# Altium schematic sheet PIC closed loop.SchDoc
size A3; SheetNumber: 17; SheetTotal: 18
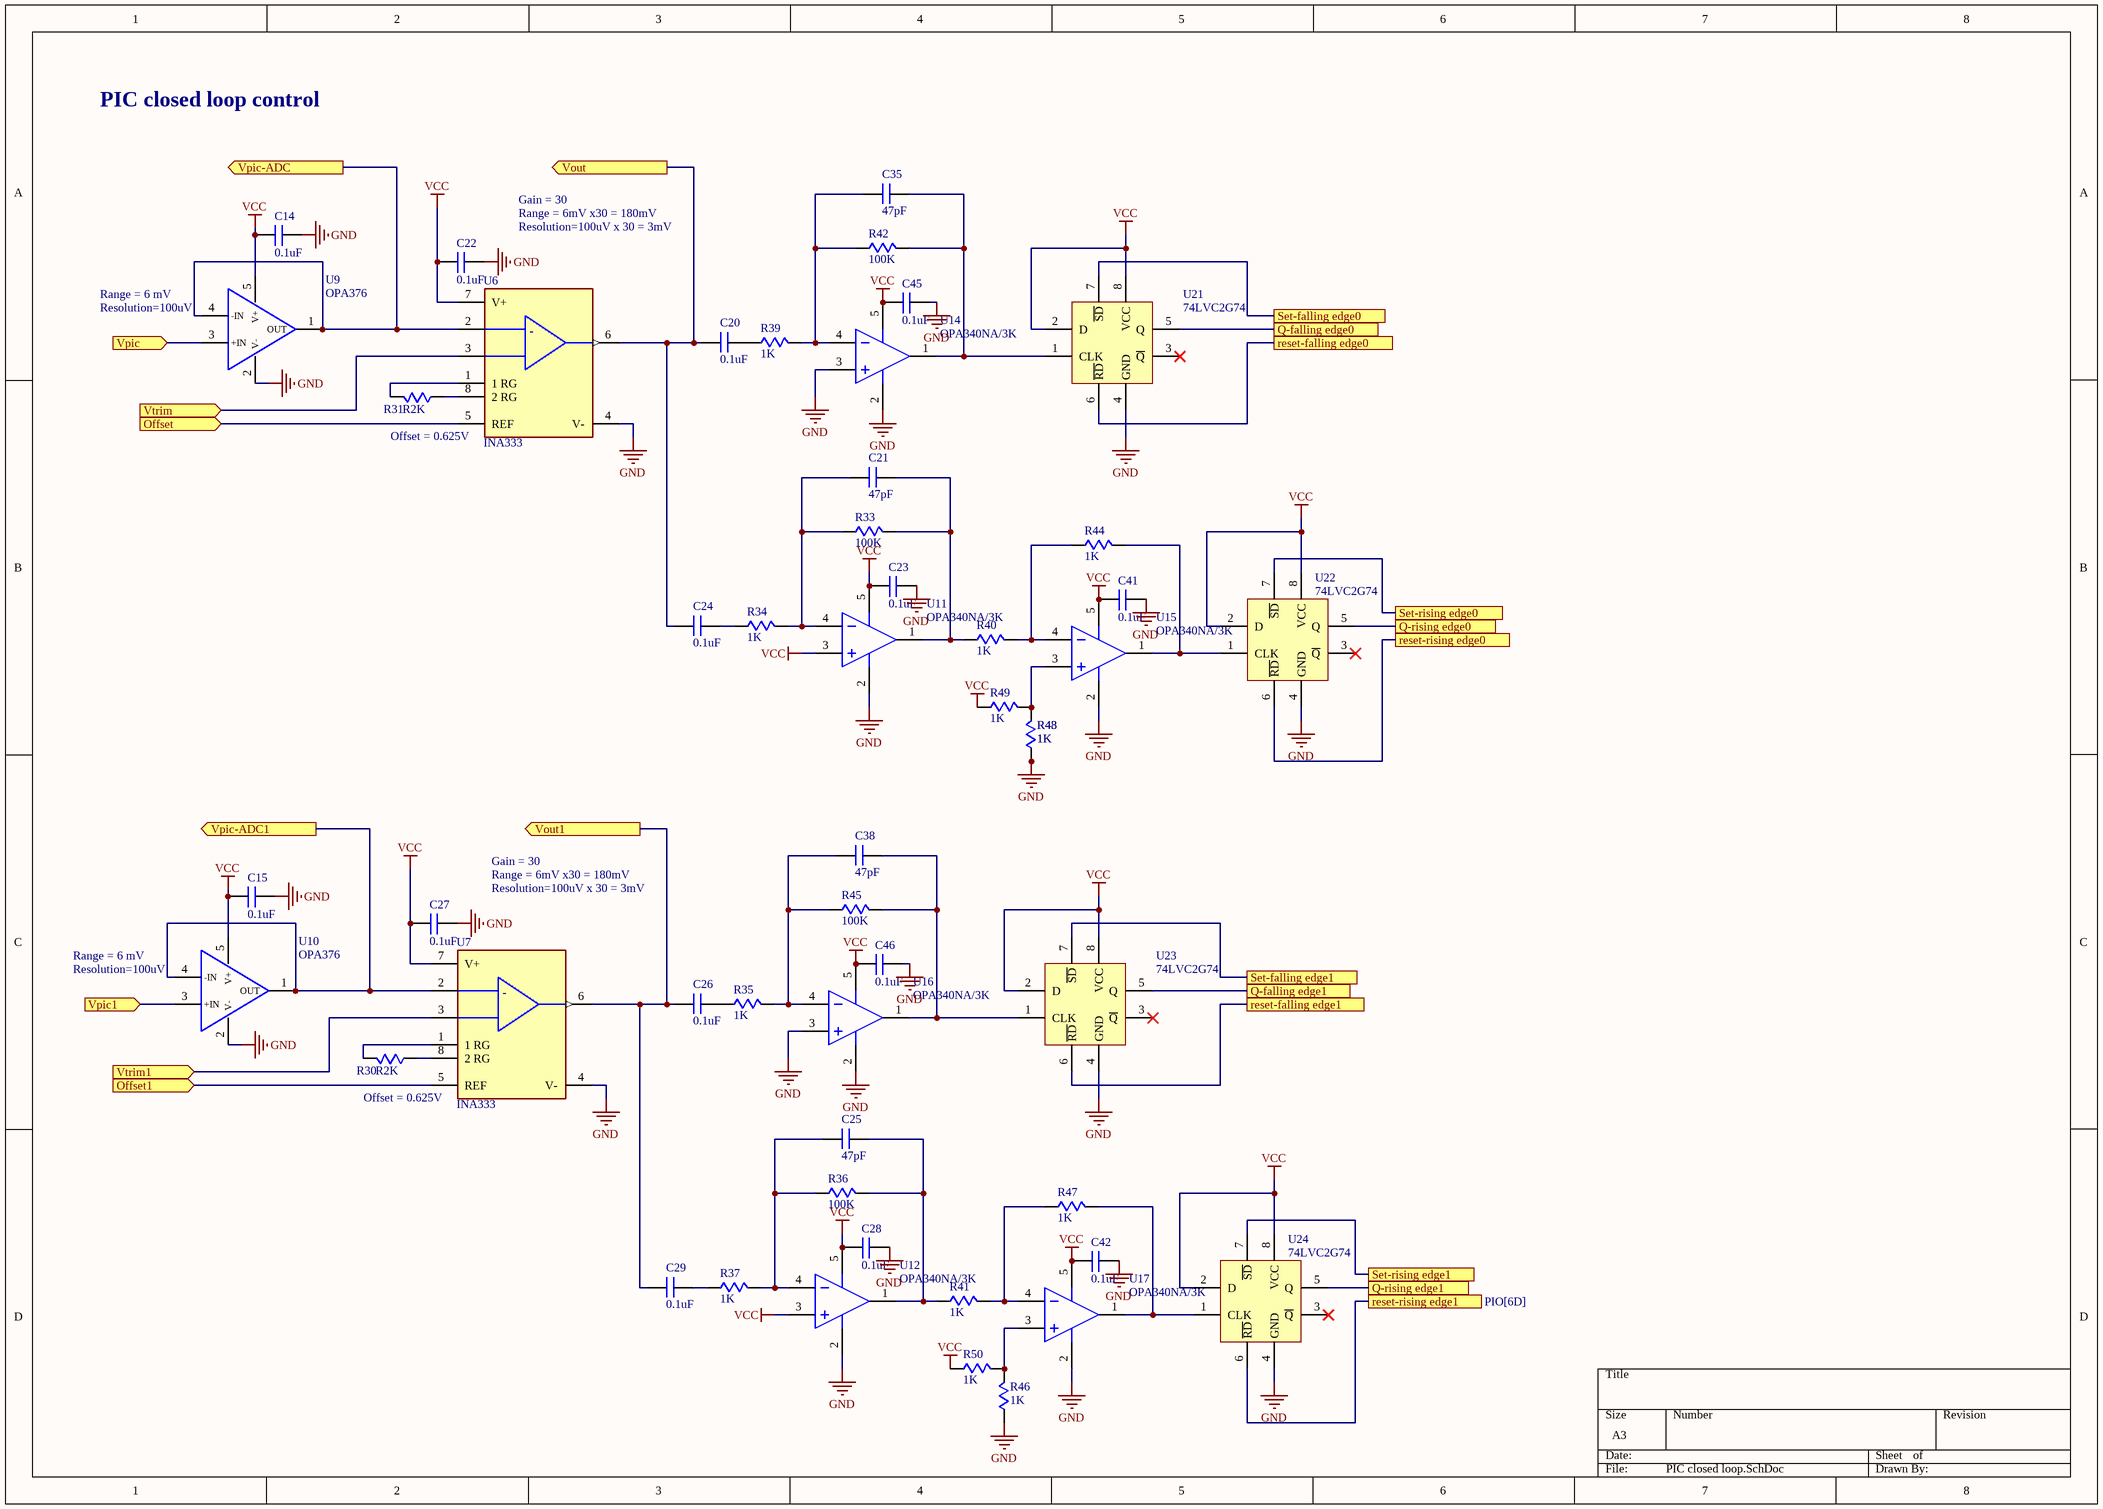
[diagram p0: PIC closed loop.SchDoc]

## Parts
C14  0.1uF  [CAP0603]
C15  0.1uF  [CAP0603]
C20  0.1uF  [CAP0603]
C21  47pF  [CAP0805]
C22  0.1uF  [CAP0603]
C23  0.1uF  [CAP0603]
C24  0.1uF  [CAP0603]
C25  47pF  [CAP0805]
C26  0.1uF  [CAP0603]
C27  0.1uF  [CAP0603]
C28  0.1uF  [CAP0603]
C29  0.1uF  [CAP0603]
C35  47pF  [CAP0805]
C38  47pF  [CAP0805]
C41  0.1uF  [CAP0603]
C42  0.1uF  [CAP0603]
C45  0.1uF  [CAP0603]
C46  0.1uF  [CAP0603]
R30  R2K  [RES0603]
R31  R2K  [RES0603]
R33  100K  [RES0805]
R34  1K  [RES0805]
R35  1K  [RES0805]
R36  100K  [RES0805]
R37  1K  [RES0805]
R39  1K  [RES0805]
R40  1K  [RES0805]
R41  1K  [RES0805]
R42  100K  [RES0805]
R43  1K  [RES0805]
R44  1K  [RES0805]
R45  100K  [RES0805]
R46  1K  [RES0805]
R47  1K  [RES0805]
R48  1K  [RES0805]
R49  1K  [RES0805]
R50  1K  [RES0805]
U6  INA333  [VSSOP-8]
U7  INA333  [VSSOP-8]
U9  OPA376  [SOT-23-5]
U10  OPA376  [SOT-23-5]
U11  OPA340NA/3K  [SOT-23]
U12  OPA340NA/3K  [SOT-23]
U14  OPA340NA/3K  [SOT-23]
U15  OPA340NA/3K  [SOT-23]
U16  OPA340NA/3K  [SOT-23]
U17  OPA340NA/3K  [SOT-23]
U21  74LVC2G74  [TSSOP8]
U22  74LVC2G74  [TSSOP8]
U23  74LVC2G74  [TSSOP8]
U24  74LVC2G74  [TSSOP8]

## Ports
Offset1 (in, see ADC-DAC[4D]), Offset (in, see ADC-DAC[4D]), Q-falling edge0 (see PIO[2D]), Q-falling edge1 (see PIO[6C]), Q-rising edge0 (see PIO[2D]), Q-rising edge1 (see PIO[6D]), reset-falling edge0 (see PIO[2D]), reset-falling edge1 (see PIO[6C]), reset-rising edge0 (see PIO[2D]), reset-rising edge1 (see PIO[6D]), Set-falling edge0 (see PIO[2C]), Set-falling edge1 (see PIO[6C]), Set-rising edge0 (see PIO[2D]), Set-rising edge1 (see PIO[6D]), Vout1 (out, see ADC-DAC[4C]), Vout (out, see ADC-DAC[4C]), Vpic1 (in, see ADC-DAC[4D]), Vpic (in, see ADC-DAC[4D]), Vpic-ADC1 (out, see ADC-DAC[7A]), Vpic-ADC (out, see ADC-DAC[5B]), Vtrim1 (in, see ADC-DAC[4D]), Vtrim (in, see ADC-DAC[4D])

## Nets
GND: C14.1 C15.1 C22.1 C23.1 C27.1 C28.1 C41.1 C42.1 C45.1 C46.1 R43.1 R46.1 R48.1 U6.4(V-) U7.4(V-) U9.2(V-) U10.2(V-) U11.2(V-) U12.2(V-) U14.2(V-) U14.3(IN+) U15.2(V-) U16.2(V-) U16.3(IN+) U17.2(V-) U21.4(GND) U22.4(GND) U23.4(GND) U24.4(GND)
VCC: C14.2 C15.2 C22.2 C23.2 C27.2 C28.2 C41.2 C42.2 C45.2 C46.2 R49.1 R50.1 U6.7(V+) U7.7(V+) U9.5(V+) U10.5(V+) U11.3(IN+) U11.5(V+) U12.3(IN+) U12.5(V+) U14.5(V+) U15.5(V+) U16.5(V+) U17.5(V+) U21.2(D) U21.8(VCC) U22.2(D) U22.8(VCC) U23.2(D) U23.8(VCC) U24.2(D) U24.8(VCC)
Offset: U6.5(REF) ; port Offset
Offset1: U7.5(REF) ; port Offset1
Q-falling edge0: U21.5(Q) ; port Q-falling edge0
Q-falling edge1: U23.5(Q) ; port Q-falling edge1
Q-rising edge0: U22.5(Q) ; port Q-rising edge0
Q-rising edge1: U24.5(Q) ; port Q-rising edge1
reset-falling edge0: U21.6(~{RD}) ; port reset-falling edge0
reset-falling edge1: U23.6(~{RD}) ; port reset-falling edge1
reset-rising edge0: U22.6(~{RD}) ; port reset-rising edge0
reset-rising edge1: U24.6(~{RD}) ; port reset-rising edge1
Set-falling edge0: U21.7(~{SD}) ; port Set-falling edge0
Set-falling edge1: U23.7(~{SD}) ; port Set-falling edge1
Set-rising edge0: U22.7(~{SD}) ; port Set-rising edge0
Set-rising edge1: U24.7(~{SD}) ; port Set-rising edge1
Vout: C20.1 C24.1 U6.6(VOUT) ; port Vout
Vout1: C26.1 C29.1 U7.6(VOUT) ; port Vout1
Vpic: U9.3(+IN) ; port Vpic
Vpic1: U10.3(+IN) ; port Vpic1
Vpic-ADC: U6.2(VIN-) U9.1(OUT) U9.4(-IN) ; port Vpic-ADC
Vpic-ADC1: U7.2(VIN-) U10.1(OUT) U10.4(-IN) ; port Vpic-ADC1
Vtrim: U6.3(VIN+) ; port Vtrim
Vtrim1: U7.3(VIN+) ; port Vtrim1
NetC20_2: C20.2 R39.1
NetC21_1: C21.1 R33.1 R34.2 U11.4(IN-)
NetC21_2: C21.2 R33.2 R40.1 U11.1(OUT)
NetC24_2: C24.2 R34.1
NetC25_1: C25.1 R36.1 R37.2 U12.4(IN-)
NetC25_2: C25.2 R36.2 R41.1 U12.1(OUT)
NetC26_2: C26.2 R35.1
NetC29_2: C29.2 R37.1
NetC35_1: C35.1 R39.2 R42.1 U14.4(IN-)
NetC35_2: C35.2 R42.2 U14.1(OUT) U21.1(CLK)
NetC38_1: C38.1 R35.2 R45.1 U16.4(IN-)
NetC38_2: C38.2 R45.2 U16.1(OUT) U23.1(CLK)
NetR30_1: R30.1 U7.8(2_RG)
NetR30_2: R30.2 U7.1(1_RG)
NetR31_1: R31.1 U6.8(2_RG)
NetR31_2: R31.2 U6.1(1_RG)
NetR40_2: R40.2 R44.1 U15.4(IN-)
NetR41_2: R41.2 R47.1 U17.4(IN-)
NetR43_2: R43.2 R48.2 R49.2 U15.3(IN+)
NetR44_2: R44.2 U15.1(OUT) U22.1(CLK)
NetR46_2: R46.2 R50.2 U17.3(IN+)
NetR47_2: R47.2 U17.1(OUT) U24.1(CLK)

Not connected (* = marked no-connect by the designer): U21 3(~{Q})*; U22 3(~{Q})*; U23 3(~{Q})*; U24 3(~{Q})*

## Notes on the sheet
- PIC closed loop control
- Range = 6mV x30 = 180mV
- Resolution=100uV x 30 = 3mV
- Gain = 30
- Range = 6 mV
- (near U9) Resolution=100uV
- (near U6) Offset = 0.625V
- (near U10) Resolution=100uV
- (near U7) Offset = 0.625V
- (in symbol INA333AIDGKT) -

## Library data of the parts
C14 C15 C20 C22-C24 C26-C29 C41 C42 C45 C46 = Capacitor 0.1uF: 50V 100nF X5R 卤10% 0603 Multilayer Ceramic Capacitors MLCC - SMD/SMT ROHS; Manufacturer: TDK; Manufacturer Part Number: C1608X5R1H104K080AA; Material: 4241ConductorMaterial; Tolerance: 10%; Supplier: Mouser; Supplier Part Number: 810-C1608X5R1H104K; RoHS: Yes; Category: Ceramic Capacitors; Stock: 239770; Pricing: 1=0.1, 10=0.051, 50=0.051, 100=0.031, 1000=0.021, 10000=0.012 (USD); Mounting Technology: Surface Mount; Case/Package: 0603; Pins: 2NUMBER; Case Code (Metric): 1608; Case Code (Imperial): 0603; Weight: 7.1E-05oz; Dielectric Material: 4241ConductorMaterial; Min Operating Temperature: -55°C; Max Operating Temperature: 85°C; Value: 100nF; Voltage Rating: 50V; Package Quantity: 1; Packaging: Tape and Reel; Voltage Rating (DC): 50V; Dielectric: X5R; Termination: SMD/SMT; Series: C; Construction: Flat; Length: 1.6mm; Width: 0.031inch; Height: 0.8mm; Thickness: 0.035inch; Depth: 0.8mm; Radiation Hardening: No; Reach SVHC Compliant: No; RoHS Compliant: Yes; Lead Free: 5697LeadFree; ComponentLink1URL: https://datasheet.ciiva.com/24219/mlcc-commercial-general-en-24219452.pdf?src-supplier=Mouser; ComponentLink1Description: https://datasheet.ciiva.com/24219/mlcc-commercial-general-en-24219452.pdf?src-supplier=Mouser; ComponentLink2URL: https://datasheet.ciiva.com/7975/1796654-7975081.pdf?src-supplier=Element14; ComponentLink2Description: https://datasheet.ciiva.com/7975/1796654-7975081.pdf?src-supplier=Element14; ComponentLink3URL: https://datasheet.ciiva.com/22694/1796654-22694121.pdf?src-supplier=Element14; ComponentLink3Description: https://datasheet.ciiva.com/22694/1796654-22694121.pdf?src-supplier=Element14; ComponentLink4URL: https://datasheet.ciiva.com/28577/1735394-28577228.pdf?src-supplier=Element14; ComponentLink4Description: https://datasheet.ciiva.com/28577/1735394-28577228.pdf?src-supplier=Element14; ComponentLink5URL: https://datasheet.ciiva.com/6275/tdkmlcccaprange-6275223.pdf?src-supplier=Digikey; ComponentLink5Description: https://datasheet.ciiva.com/6275/tdkmlcccaprange-6275223.pdf?src-supplier=Digikey; Supplier 1: Mouser; Supplier Part Number 1: 810-C1608X5R1H104K
C21 C25 C35 C38 = Capactior 47pF: Cap Cer 4.7PF 100V C0G/NP0 0805; Manufacturer: Wurth Electronics; Manufacturer Part Number: 885012007096; Insulation Resistance: 10GR; Supplier: Mouser; Supplier Part Number: 710-885012007096; RoHS: No; Category: Ceramic Capacitors; Stock: 8470; Voltage Rating (DC): 100V; Length: 2mm; Width: 1.25mm; Height: 600um; ComponentLink1URL: http://www.farnell.com/datasheets/2546659.pdf?src-supplier=Farnell; ComponentLink1Description: http://www.farnell.com/datasheets/2546659.pdf?src-supplier=Farnell; ComponentLink2URL: https://katalog.we-online.de/pbs/datasheet/885012007096.pdf?src-supplier=Digikey; ComponentLink2Description: https://katalog.we-online.de/pbs/datasheet/885012007096.pdf?src-supplier=Digikey; Supplier 1: Mouser; Supplier Part Number 1: 710-885012007096
R30 R31 = Resistor 2K: Res Thin Film 0603 2K Ohm 0.1% 1/10W ±25ppm/°C Molded SMD SMD Paper T/R; Manufacturer: Yageo; Manufacturer Part Number: RT0603BRD072KL; Value: 2kR; Power Rating: 100mW; Voltage Rating: 75V; Voltage Rating (DC): 50V; Supplier: Mouser; Supplier Part Number: 603-RT0603BRD072KL; RoHS: Yes; Category: Chip SMD Resistors; Stock: 66196; Pricing: 1=0.1, 10=0.069, 50=0.061, 100=0.057, 1000=0.052, 10000=0.035 (USD); Case/Package: 0603; Contact Plating: Tin,Matte; Case Code (Imperial): 0603; Weight: 7.1E-05oz; Case Code (Metric): 1608; Min Operating Temperature: -55°C; Max Operating Temperature: 125°C; Tolerance: 0.1%; Temperature Coefficient: 25ppm/°C; Termination: SMD/SMT; Number of Terminations: 2; Max Power Dissipation: 100mW; Features: Moisture Resistant; Package Quantity: 5000; Packaging: Tape and Reel; Series: RT; Length: 0.063inch; Width: 0.8mm; Height: 0.022inch; Lead Free: Lead Free; RoHS Compliant: Yes; ComponentLink1URL: https://datasheet.ciiva.com/8894/pyu-rt-1-to-0-05-rohs-l-4-8894812.pdf?src-supplier=Avnet; ComponentLink1Description: https://datasheet.ciiva.com/8894/pyu-rt-1-to-0-05-rohs-l-4-8894812.pdf?src-supplier=Avnet; ComponentLink2URL: https://datasheet.ciiva.com/2585/pyu-rt-1-to-0-05-rohs-l-4-2585865.pdf?src-supplier=Digikey; ComponentLink2Description: https://datasheet.ciiva.com/2585/pyu-rt-1-to-0-05-rohs-l-4-2585865.pdf?src-supplier=Digikey
R33 R36 R42 R45 = Resistor 100K: Res Thick Film 0805 100K Ohm 5% 0.125W(1/8W) +/-200ppm/ßC SMD Automotive T/R; Manufacturer: Panasonic; Manufacturer Part Number: ERJ-6GEYJ104V; Value: 100kR; Temperature Coefficient: 200ppm/°C; Power Rating: 125mW; Voltage Rating: 150V; Supplier 1: Mouser; Supplier Part Number 1: 279-RN73CA-100K; Supplier: Mouser; Supplier Part Number: 667-ERJ-6GEYJ104V; RoHS: Yes; Category: Chip SMD Resistors; Stock: 35881; Pricing: 1=0.12, 10=0.027, 50=0.027, 100=0.018, 1000=0.015, 10000=0.007 (USD); Mounting Technology: Surface Mount; Case/Package: 0805; Pins: 2NUMBER; Contact Plating: Tin; Case Code (Metric): 2012; Case Code (Imperial): 0805; Weight: 0.000194oz; Min Operating Temperature: -55°C; Max Operating Temperature: 155°C; Tolerance: 5%; Resistor Type: Thick Film; Packaging: Tape and Reel; Package Quantity: 5000; Number of Terminations: 2; Termination: SMD/SMT; Max Power Dissipation: 125mW; Features: Automotive AEC-Q200; Series: ERJ; Technology: THICK FILM; Construction: Rectangular; Resistance Tolerance: 5%; Voltage Rating (DC): 150V; Length: 2mm; Width: 1.25mm; Height: 0.6mm; Depth: 1.25mm; Radiation Hardening: No; Reach SVHC Compliant: No; Military Standard: Not; RoHS Compliant: Yes; Lead Free: 5697LeadFree; ComponentLink1URL: https://datasheet.ciiva.com/34303/2007290-34303759.pdf?src-supplier=Jameco; ComponentLink1Description: https://datasheet.ciiva.com/34303/2007290-34303759.pdf?src-supplier=Jameco; ComponentLink2URL: https://datasheet.ciiva.com/11821/0900766b80f806dd-11821506.pdf?src-supplier=Rs; ComponentLink2Description: https://datasheet.ciiva.com/11821/0900766b80f806dd-11821506.pdf?src-supplier=Rs; ComponentLink3URL: https://datasheet.ciiva.com/43460/1500035-43460136.pdf?src-supplier=Farnell; ComponentLink3Description: https://datasheet.ciiva.com/43460/1500035-43460136.pdf?src-supplier=Farnell; ComponentLink4URL: https://datasheet.ciiva.com/22758/1500035-22758234.pdf?src-supplier=Farnell; ComponentLink4Description: https://datasheet.ciiva.com/22758/1500035-22758234.pdf?src-supplier=Farnell; ComponentLink5URL: https://datasheet.ciiva.com/46380/1500035-46380511.pdf?src-supplier=Element14; ComponentLink5Description: https://datasheet.ciiva.com/46380/1500035-46380511.pdf?src-supplier=Element14; ComponentLink6URL: https://datasheet.ciiva.com/16771/70255313-16771462.pdf?src-supplier=Allied+Electronics; ComponentLink6Description: https://datasheet.ciiva.com/16771/70255313-16771462.pdf?src-supplier=Allied+Electronics; ComponentLink7URL: https://datasheet.ciiva.com/9117/aoa0000ce1-9117374.pdf?src-supplier=Avnet; ComponentLink7Description: https://datasheet.ciiva.com/9117/aoa0000ce1-9117374.pdf?src-supplier=Avnet; ComponentLink8URL: https://datasheet.ciiva.com/30137/4aoa0000ce1-30137389.pdf?src-supplier=Onlinecomponents.com; ComponentLink8Description: https://datasheet.ciiva.com/30137/4aoa0000ce1-30137389.pdf?src-supplier=Onlinecomponents.com
R34 R35 R37 R39-R41 R43 R44 R46-R50 = Resistor 1K
U6 U7 = INA333AIDGKT: IC INST AMP 1 CIRCUIT 8VSSOP Instrumentation Amplifier 1 Circuit Rail-to-Rail 8-VSSOP; Manufacturer: Texas Instruments; Manufacturer Lifecycle Status: ACTIVE; -3db Bandwidth: 150kHz; Common Mode Rejection Ratio: 100dB; Input Bias Current: 70pA; Input Offset Voltage (Vos): 25µV; Max Dual Supply Voltage: 2.75V; Max Junction Temperature (Tj): 150°C; Max Supply Current: 75µA; Max Supply Voltage: 5.5V; Min Dual Supply Voltage: 900mV; Min Supply Voltage: 1.8V; Nominal Supply Current: 50µA; Number of Amplifiers: 1; Number of Elements: 3; Output Current per Channel: 40mA; Power Supply Rejection Ratio (PSRR): 120dB; Value: 100GΩ; Slew Rate: 0.16V/µs; Voltage Gain: 60dB; Supplier: Mouser; Supplier Part Number: 595-INA333AIDGKT; Manufacturer Part Number: INA333AIDGKT; RoHS: Compliant; Category: Amplifiers - Op Amps, Buffer, Instrumentation; Stock: 4360; Ambient Temperature Range High: 125°C; Bandwidth: 150kHz; Case/Package: VSSOP; Gain Bandwidth Product: 150kHz; Height: 0m; Lead Free: Lead Free; Length: 3mm; Lifecycle Status: Production; Max Operating Temperature: 125°C; Min Operating Temperature: -40°C; Number of Channels: 1; Number of Circuits: 1; Pins: 8; Operating Supply Current: 50µA; Quiescent Current: 50µA; Radiation Hardening: No; REACH SVHC: No; Schedule B: 8542330000, 8542330000|8542330000|8542330000|8542330000|8542330000|8542330000|8542330000|8542330000|8542330000|8542330000|8542330000|8542330000|8542330000|8542330000|8542330000|8542330000|8542330000|8542330000|8542330000|8542330000|8542330000|8542330000|8542330000|85; Thickness: 970µm; Weight: 26.506804mg; Width: 3mm; ComponentLink1URL: https://sigma.octopart.com:443/178522223/technical_drawing/Texas-Instruments-INA333AIDGKT.pdf?src-supplier=Texas+Instruments; ComponentLink1Description: https://sigma.octopart.com:443/178522223/technical_drawing/Texas-Instruments-INA333AIDGKT.pdf?src-supplier=Texas+Instruments; ComponentLink2URL: https://octopart.com:443/opatz8j6/c1?t=V-fXB-rW8jv6fZO42Xyeii-VbSduNs_sypYrbIAapb8q-gef3LibjYtXIxlRxKElxMoNQnTuiMj8fJDwQC7p1wsXU82Nf5KzMMEUlZU6NM7WLFRVjXH6z6_5ibc0BewWLNUAVqlUzV9zOoWoa8sKVJurnvTC26LvhOb60JTxJWGz_lMtxfG2gwWfzn0OBkEnAwIBI0ugQCUIg70evWR0bIK6L-5NECTMU-gf3l-vwrJZ1XbBUM96S_Td2M5M8hc4UVOubiMbDDYiWeG3BE1nzII6D67RVcdz5ib3izF7gT1Fzk9wewYzsqh4K7kTAYR21MEJOv9DjSf59eS-SZmh4NGmW3yyPbkOF_cwYzkKBAViD-S_Foru0ymOmvmM4NJ_caOk&src-supplier=Texas+Instruments; ComponentLink2Description: https://octopart.com:443/opatz8j6/c1?t=V-fXB-rW8jv6fZO42Xyeii-VbSduNs_sypYrbIAapb8q-gef3LibjYtXIxlRxKElxMoNQnTuiMj8fJDwQC7p1wsXU82Nf5KzMMEUlZU6NM7WLFRVjXH6z6_5ibc0BewWLNUAVqlUzV9zOoWoa8sKVJurnvTC26LvhOb60JTxJWGz_lMtxfG2gwWfzn0OBkEnAwIBI0ugQCUIg70evWR0bIK6L-5NECTMU-gf3l-vwrJZ1XbBUM96S_Td2M5M8hc4UVOubiMbDDYiWeG3BE1nzII6D67RVcdz5ib3izF7gT1Fzk9wewYzsqh4K7kTAYR21MEJOv9DjSf59eS-SZmh4NGmW3yyPbkOF_cwYzkKBAViD-S_Foru0ymOmvmM4NJ_caOk&src-supplier=Texas+Instruments; ComponentLink3URL: https://datasheet.octopart.com:443/INA333AIDGKT-Texas-Instruments-datasheet-10254260.pdf?src-supplier=Texas+Instruments; ComponentLink3Description: https://datasheet.octopart.com:443/INA333AIDGKT-Texas-Instruments-datasheet-10254260.pdf?src-supplier=Texas+Instruments; ComponentLink4URL: https://sigma.octopart.com:443/49250154/technical_drawing/Texas-Instruments-INA333AIDGKT.pdf?src-supplier=Texas+Instruments; ComponentLink4Description: https://sigma.octopart.com:443/49250154/technical_drawing/Texas-Instruments-INA333AIDGKT.pdf?src-supplier=Texas+Instruments; ComponentLink5URL: https://datasheet.octopart.com:443/INA333AIDGKT-Texas-Instruments-datasheet-33010170.pdf?src-supplier=Newark; ComponentLink5Description: https://datasheet.octopart.com:443/INA333AIDGKT-Texas-Instruments-datasheet-33010170.pdf?src-supplier=Newark; ComponentLink6URL: https://datasheet.octopart.com:443/INA333AIDGKT-Texas-Instruments-datasheet-21221252.pdf?src-supplier=Newark; ComponentLink6Description: https://datasheet.octopart.com:443/INA333AIDGKT-Texas-Instruments-datasheet-21221252.pdf?src-supplier=Newark; ComponentLink7URL: https://datasheet.octopart.com:443/INA333AIDGKT-Texas-Instruments-datasheet-102489501.pdf?src-supplier=Upverter; ComponentLink7Description: https://datasheet.octopart.com:443/INA333AIDGKT-Texas-Instruments-datasheet-102489501.pdf?src-supplier=Upverter; ComponentLink8URL: https://datasheet.octopart.com:443/INA333AIDGKT-Texas-Instruments-datasheet-13550866.pdf?src-supplier=Upverter; ComponentLink8Description: https://datasheet.octopart.com:443/INA333AIDGKT-Texas-Instruments-datasheet-13550866.pdf?src-supplier=Upverter; ComponentLink9URL: https://datasheet.octopart.com:443/INA333AIDGKT-Texas-Instruments-datasheet-14137325.pdf?src-supplier=iiiC; ComponentLink9Description: https://datasheet.octopart.com:443/INA333AIDGKT-Texas-Instruments-datasheet-14137325.pdf?src-supplier=iiiC; ComponentLink10URL: https://datasheet.octopart.com:443/INA333AIDGKT-Texas-Instruments-datasheet-11537799.pdf?src-supplier=Farnell; ComponentLink10Description: https://datasheet.octopart.com:443/INA333AIDGKT-Texas-Instruments-datasheet-11537799.pdf?src-supplier=Farnell; ComponentLink11URL: https://datasheet.octopart.com:443/INA333AIDGKT-Texas-Instruments-datasheet-10888318.pdf?src-supplier=Farnell; ComponentLink11Description: https://datasheet.octopart.com:443/INA333AIDGKT-Texas-Instruments-datasheet-10888318.pdf?src-supplier=Farnell; ComponentLink12URL: https://datasheet.octopart.com:443/INA333AIDGKT-Texas-Instruments-datasheet-5396508.pdf?src-supplier=Farnell; ComponentLink12Description: https://datasheet.octopart.com:443/INA333AIDGKT-Texas-Instruments-datasheet-5396508.pdf?src-supplier=Farnell; ComponentLink13URL: http://sigma.octopart.com:80/reach_statement/Texas-Instruments-company-64.pdf?src-supplier=Compliance+Statements; ComponentLink13Description: http://sigma.octopart.com:80/reach_statement/Texas-Instruments-company-64.pdf?src-supplier=Compliance+Statements; ComponentLink14URL: http://sigma.octopart.com:80/conflict_mineral_statement/Texas-Instruments-company-63.pdf?src-supplier=Compliance+Statements; ComponentLink14Description: http://sigma.octopart.com:80/conflict_mineral_statement/Texas-Instruments-company-63.pdf?src-supplier=Compliance+Statements; Supplier 1: Mouser; Supplier Part Number 1: 595-INA333AIDGKT
U9 U10 = OPA376: Automotive Precision, Low Noise, Low Iq Operational Amplifier 5-SOT-23 -40 to 125; Manufacturer: Texas Instruments; Manufacturer Part Number: OPA376AQDBVRQ1; Supplier: Mouser; Supplier Part Number: 595-OPA376AQDBVRQ1; RoHS: Yes; Category: Amplifiers - Op Amps, Buffer, Instrumentation; Stock: 771; Pricing: 1=2.02, 10=1.49, 50=1.36, 100=1.22, 1000=1.07, 10000=0.981 (USD); Length: 2.9mm; Width: 1.6mm; Height: 1.45mm; Thickness: 1.2mm; Lead Free: 5697LeadFree; ComponentLink1URL: https://datasheet.ciiva.com/14456/sbos549-14456362.pdf?src-supplier=Avnet; ComponentLink1Description: https://datasheet.ciiva.com/14456/sbos549-14456362.pdf?src-supplier=Avnet; ComponentLink2URL: https://datasheet.ciiva.com/1813/opa376-q1-1813824.pdf?src-supplier=Digikey; ComponentLink2Description: https://datasheet.ciiva.com/1813/opa376-q1-1813824.pdf?src-supplier=Digikey
U11 U12 U14-U17 = OPA340: Operational Amplifier Single General Purpose Rail to Rail Input 5.5V 5-Pin SOT-23 Tape and Reel; Manufacturer: Texas Instruments; Supplier: Mouser; Supplier Part Number: 595-OPA340NA/3K; Manufacturer Part Number: OPA340NA/3K; RoHS: Yes; Category: Amplifiers - Op Amps, Buffer, Instrumentation; Stock: 33077; Length: 2.9mm; Width: 1.6mm; Height: 1.45mm; Thickness: 1.2mm; Lead Free: 5697LeadFree; ComponentLink1URL: https://datasheet.ciiva.com/4755/sbos073b-93957-4755984.pdf?src-supplier=Mouser; ComponentLink1Description: https://datasheet.ciiva.com/4755/sbos073b-93957-4755984.pdf?src-supplier=Mouser; ComponentLink2URL: https://datasheet.ciiva.com/27052/1488520-27052284.pdf?src-supplier=Jameco; ComponentLink2Description: https://datasheet.ciiva.com/27052/1488520-27052284.pdf?src-supplier=Jameco; ComponentLink3URL: https://datasheet.ciiva.com/49118/1861007-49118271.pdf?src-supplier=Element14; ComponentLink3Description: https://datasheet.ciiva.com/49118/1861007-49118271.pdf?src-supplier=Element14; ComponentLink4URL: https://datasheet.ciiva.com/1813/opa2340-1813818.pdf?src-supplier=Digikey; ComponentLink4Description: https://datasheet.ciiva.com/1813/opa2340-1813818.pdf?src-supplier=Digikey; ComponentLink5URL: https://datasheet.ciiva.com/1813/opa2340-1813819.pdf?src-supplier=Digikey; ComponentLink5Description: https://datasheet.ciiva.com/1813/opa2340-1813819.pdf?src-supplier=Digikey; ComponentLink6URL: https://datasheet.ciiva.com/1813/opa2340-1813820.pdf?src-supplier=Digikey; ComponentLink6Description: https://datasheet.ciiva.com/1813/opa2340-1813820.pdf?src-supplier=Digikey; ComponentLink7URL: https://datasheet.ciiva.com/2974/sbos073b-2974003.pdf?src-supplier=Avnet; ComponentLink7Description: https://datasheet.ciiva.com/2974/sbos073b-2974003.pdf?src-supplier=Avnet; Supplier 1: Mouser; Supplier Part Number 1: 595-OPA340NA/3K
U21-U24 = 74LVC2G74DP,125: Flip-Flop with Set And Reset Single D-Type Positive Edge Trigger 1.65V to 5.5V 8-Pin TSSOP; Manufacturer: Nexperia; Frequency: 200MHz; Output Current: 50mA; Supplier: Mouser; Supplier Part Number: 771-74LVC2G74DP-G; Manufacturer Part Number: 74LVC2G74DP,125; RoHS: Yes; Category: Latches and Flip Flops; Stock: 110790; Pins: 8NUMBER; Packaging: 10Packaging; ComponentLink1URL: https://datasheet.octopart.com/74LVC2G74DP%2C125-Nexperia-datasheet-17482457.pdf?src-supplier=Newark; ComponentLink1Description: https://datasheet.octopart.com/74LVC2G74DP%2C125-Nexperia-datasheet-17482457.pdf?src-supplier=Newark; ComponentLink2URL: https://datasheet.octopart.com/74LVC2G74DP%2C125-NXP-datasheet-8327349.pdf?src-supplier=Future+Electronics; ComponentLink2Description: https://datasheet.octopart.com/74LVC2G74DP%2C125-NXP-datasheet-8327349.pdf?src-supplier=Future+Electronics